# Altium schematic sheet QRcode.SchDoc
size A4
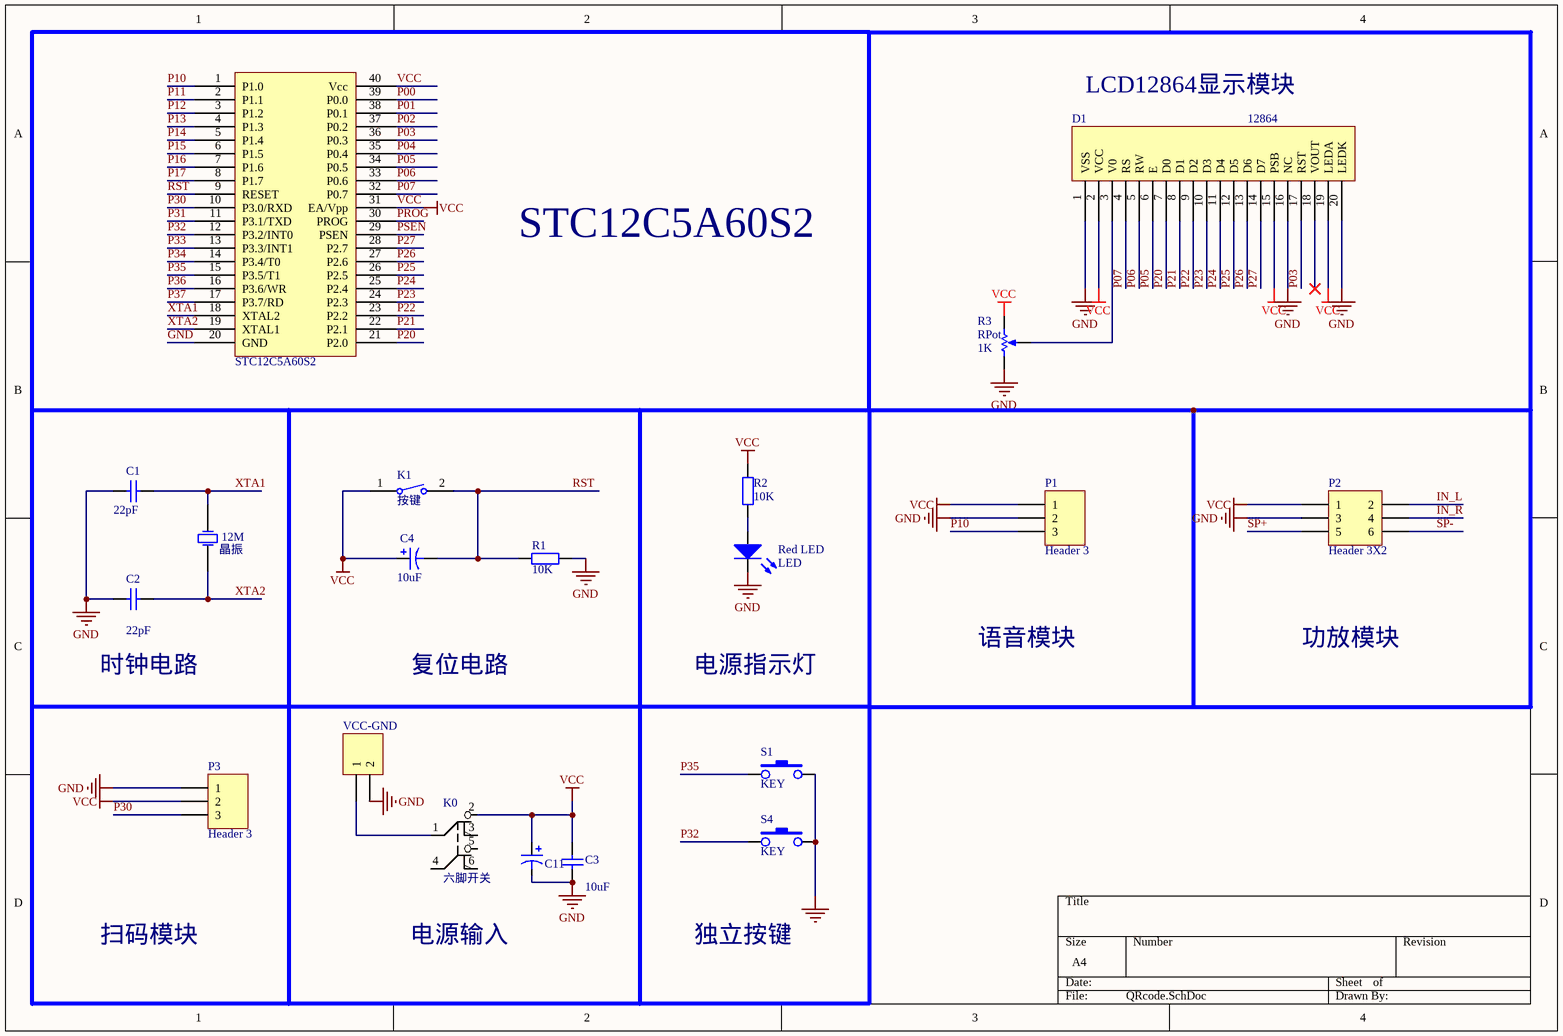
[diagram p0: QRcode.SchDoc]

## Parts
12M  晶振  [晶振]
C1  value 22pF  [0805]
C2  value 22pF  [0805]
C3  value 10uF  [0805]
C4  value 10uF  [RB7.6-15]  (hidden comment: Cap Pol1)
C11  100UF/470UF(封装慎选)  [ED6.3]  (value not drawn)
D1  12864  [SIP20]
K0  六脚开关  [按钮开关]
K1  按键  [按键]
P1  Header 3  [HDR1X3]
P2  Header 3X2  [HDR2X3]
P3  Header 3  [HDR1X3]
R1  10K  [0805]
R2  10K  [0805]
R3  RPot  value 1K  [VR5]
Red_LED  LED  [LED(0805)]
S1  KEY  [SWITCH]
S4  KEY  [SWITCH]
STC89C52  STC12C5A60S2  [89C51]
VCC-GND  (no value)  [HDR1X2]

## Nets
GND: C1.1 C2.1 C3.1 C11.2 D1.1(VSS) D1.16(NC) D1.20(LEDK) P1.2 P2.3 P3.1 R1.2 R3.1(TOP) Red_LED.2(K) S1.2 S4.2 STC89C52.20(GND) VCC-GND.2
VCC: C3.2 C4.1 C11.1 D1.2(VCC) D1.15(PSB) D1.19(LEDA) K0.2 K1.1 P1.1 P2.1 P3.2 R2.2 R3.2(BOT) STC89C52.31(EA/Vpp) STC89C52.40(Vcc)
IN_L: P2.2
IN_R: P2.4
P00: STC89C52.39(P0.0)
P01: STC89C52.38(P0.1)
P02: STC89C52.37(P0.2)
P03: D1.17(RST) STC89C52.36(P0.3)
P04: STC89C52.35(P0.4)
P05: D1.6(E) STC89C52.34(P0.5)
P06: D1.5(RW) STC89C52.33(P0.6)
P07: D1.4(RS) STC89C52.32(P0.7)
P10: P1.3 STC89C52.1(P1.0)
P11: STC89C52.2(P1.1)
P12: STC89C52.3(P1.2)
P13: STC89C52.4(P1.3)
P14: STC89C52.5(P1.4)
P15: STC89C52.6(P1.5)
P16: STC89C52.7(P1.6)
P17: STC89C52.8(P1.7)
P20: D1.7(D0) STC89C52.21(P2.0)
P21: D1.8(D1) STC89C52.22(P2.1)
P22: D1.9(D2) STC89C52.23(P2.2)
P23: D1.10(D3) STC89C52.24(P2.3)
P24: D1.11(D4) STC89C52.25(P2.4)
P25: D1.12(D5) STC89C52.26(P2.5)
P26: D1.13(D6) STC89C52.27(P2.6)
P27: D1.14(D7) STC89C52.28(P2.7)
P30: P3.3 STC89C52.10(P3.0/RXD)
P31: STC89C52.11(P3.1/TXD)
P32: S4.1 STC89C52.12(P3.2/INT0)
P33: STC89C52.13(P3.3/INT1)
P34: STC89C52.14(P3.4/T0)
P35: S1.1 STC89C52.15(P3.5/T1)
P36: STC89C52.16(P3.6/WR)
P37: STC89C52.17(P3.7/RD)
PROG: STC89C52.30(PROG)
PSEN: STC89C52.29(PSEN)
RST: C4.2 K1.2 R1.1 STC89C52.9(RESET)
SP+: P2.5
SP-: P2.6
XTA1: 12M.2 C1.2 STC89C52.18(XTAL2)
XTA2: 12M.1 C2.2 STC89C52.19(XTAL1)
NetD1_3: D1.3(V0) R3.3(TAP)
NetK0_1: K0.1 VCC-GND.1
NetR2_1: R2.1 Red_LED.1(A)

Not connected (* = marked no-connect by the designer): D1 18(VOUT)*; K0 3 4 5 6

## Notes on the sheet
- LCD12864显示模块
- STC12C5A60S2
- 语音模块
- 功放模块
- 时钟电路
- 复位电路
- 电源指示灯
- 扫码模块
- 电源输入
- 独立按键

## Library data of the parts
C1-C3 = Cap: 无极电容; MADE IN: JMU 智能车制造中心
C4 = Cap Pol1: Polarized Capacitor (Radial); Published: 8-Jun-2000; LatestRevisionDate: 17-Jul-2002; LatestRevisionNote: Re-released for DXP Platform.; PackageReference: RB7.6-15; Publisher: Altium Limited; PackageDescription: Polarized Capacitor (Radial); 2 Leads
C11 = 固态贴片电容: ED8:470UF  ED6.3:100UF; MADE IN: JMU 智能车制造中心
K0 = 六脚开关: 按钮开关; MADE IN: JMU 智能车制造中心
P1 P3 = Header 3: Header, 3-Pin; LatestRevisionDate: 17-Jul-2002; LatestRevisionNote: Re-released for DXP Platform.; Publisher: Altium Limited
P2 = Header 3X2: Header, 3-Pin, Dual row; LatestRevisionDate: 17-Jul-2002; LatestRevisionNote: Re-released for DXP Platform.; Publisher: Altium Limited
R1 R2 = Res: 通用电阻; MADE IN: JMU 智能车制造中心; Value: 10K
R3 = RPot: Potentiometer; Sim Note: Enter the Resistance value and the set point into parameter fields.; Set Position: 0.5; Published: 8-Jun-2000; LatestRevisionDate: 17-Jul-2002; LatestRevisionNote: Re-released for DXP Platform.; PackageReference: VR5; Publisher: Altium Limited; PackageDescription: Variable Resistor, Thru-Hole; 3 Leads
Red_LED = LED: 发光二极管; MADE IN: JMU 智能车制造中心
STC89C52 = Component_1
VCC-GND = Header 2: Header, 2-Pin; LatestRevisionDate: 17-Jul-2002; LatestRevisionNote: Re-released for DXP Platform.; Publisher: Altium Limited